# EAGLE design Arduboy Kit (EAGLE 9.7.0)
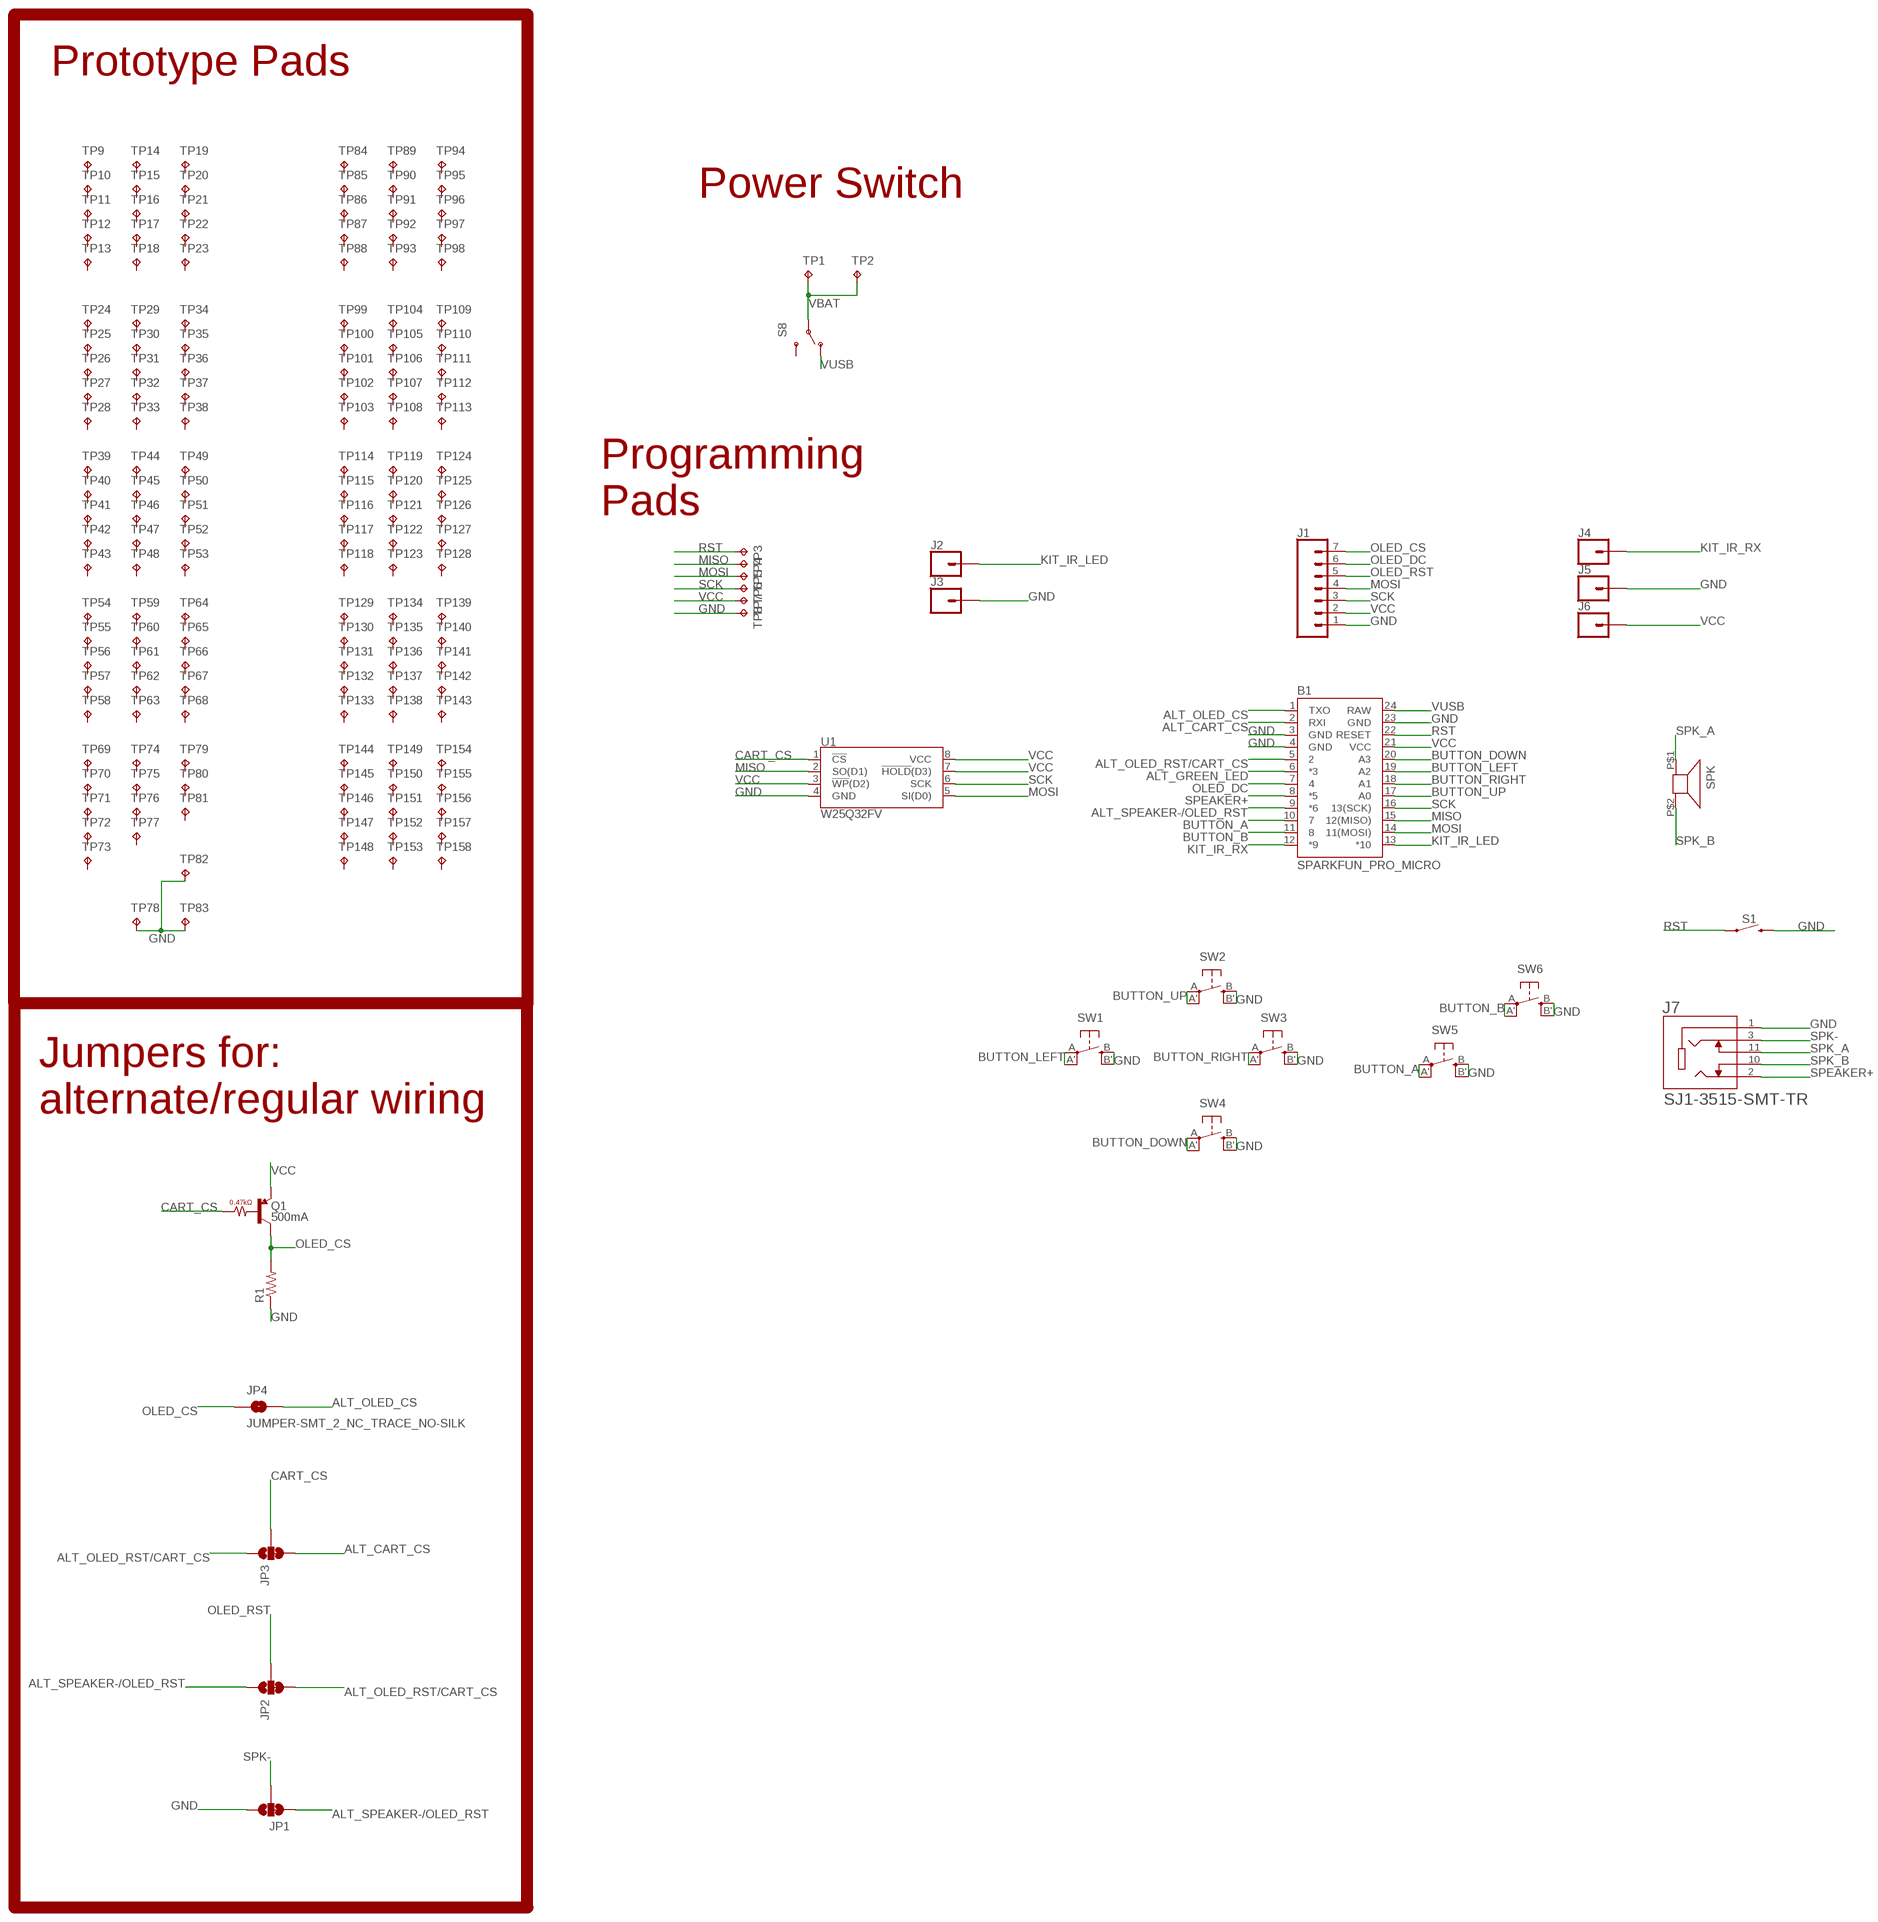
[diagram p0: schematic, sheet 1]

## Parts
B1  SPARKFUN_PRO_MICRO  [SPARKFUN_PRO_MICRO]
J1  CONN_07NO_SILK  [1X07_NO_SILK]
J2  CONN_01PAD  [1X01_SOLDER_PADS]
J3  CONN_01PAD  [1X01_SOLDER_PADS]
J4  CONN_01PAD  [1X01_SOLDER_PADS]
J5  CONN_01PAD  [1X01_SOLDER_PADS]
J6  CONN_01PAD  [1X01_SOLDER_PADS]
J7  SJ1-3515-SMT-TR  [CUI_SJ1-3515-SMT-TR]
JP1  JUMPER-SMT_3_1-NC_TRACE_NO-SILK  [SMT-JUMPER_3_1-NC_TRACE_NO-SILK]
JP2  JUMPER-SMT_3_1-NC_TRACE_NO-SILK  [SMT-JUMPER_3_1-NC_TRACE_NO-SILK]
JP3  JUMPER-SMT_3_1-NC_TRACE_NO-SILK  [SMT-JUMPER_3_1-NC_TRACE_NO-SILK]
JP4  JUMPER-SMT_2_NC_TRACE_NO-SILK  [SMT-JUMPER_2_NC_TRACE_NO-SILK]
Q1  500mA  TRANS_PNP_RES-DDTB142TC  [SOT23-3]
R1  R-US_R0805  [R0805]
S1  MOMENTARY-SWITCH-SPST-SMD-6.0X3.5MM  [TACTILE_SWITCH_SMD_6.0X3.5MM]
S8  SWITCH-SPDT-SMD-A  [SWITCH-SPST-SMD-A]
SPK  O_SPK_2_FLEX  [O_SPK_FLEX]
SW1  SPST_TACT-EVQQ2  [EVQ-Q2]
SW2  SPST_TACT-EVQQ2  [EVQ-Q2]
SW3  SPST_TACT-EVQQ2  [EVQ-Q2]
SW4  SPST_TACT-EVQQ2  [EVQ-Q2]
SW5  SPST_TACT-EVQQ2  [EVQ-Q2]
SW6  SPST_TACT-EVQQ2  [EVQ-Q2]
TP1  TPTP20SQ  [TP20SQ]
TP2  TPTP20SQ  [TP20SQ]
TP3  TPTP15SQ  [TP15SQ]
TP4  TPTP15SQ  [TP15SQ]
TP5  TPTP15SQ  [TP15SQ]
TP6  TPTP15SQ  [TP15SQ]
TP7  TPTP15SQ  [TP15SQ]
TP8  TPTP15SQ  [TP15SQ]
TP9  TPTP20SQ  [TP20SQ]
TP10  TPTP20SQ  [TP20SQ]
TP11  TPTP20SQ  [TP20SQ]
TP12  TPTP20SQ  [TP20SQ]
TP13  TPTP20SQ  [TP20SQ]
TP14  TPTP20SQ  [TP20SQ]
TP15  TPTP20SQ  [TP20SQ]
TP16  TPTP20SQ  [TP20SQ]
TP17  TPTP20SQ  [TP20SQ]
TP18  TPTP20SQ  [TP20SQ]
TP19  TPTP20SQ  [TP20SQ]
TP20  TPTP20SQ  [TP20SQ]
TP21  TPTP20SQ  [TP20SQ]
TP22  TPTP20SQ  [TP20SQ]
TP23  TPTP20SQ  [TP20SQ]
TP24  TPTP20SQ  [TP20SQ]
TP25  TPTP20SQ  [TP20SQ]
TP26  TPTP20SQ  [TP20SQ]
TP27  TPTP20SQ  [TP20SQ]
TP28  TPTP20SQ  [TP20SQ]
TP29  TPTP20SQ  [TP20SQ]
TP30  TPTP20SQ  [TP20SQ]
TP31  TPTP20SQ  [TP20SQ]
TP32  TPTP20SQ  [TP20SQ]
TP33  TPTP20SQ  [TP20SQ]
TP34  TPTP20SQ  [TP20SQ]
TP35  TPTP20SQ  [TP20SQ]
TP36  TPTP20SQ  [TP20SQ]
TP37  TPTP20SQ  [TP20SQ]
TP38  TPTP20SQ  [TP20SQ]
TP39  TPTP20SQ  [TP20SQ]
TP40  TPTP20SQ  [TP20SQ]
TP41  TPTP20SQ  [TP20SQ]
TP42  TPTP20SQ  [TP20SQ]
TP43  TPTP20SQ  [TP20SQ]
TP44  TPTP20SQ  [TP20SQ]
TP45  TPTP20SQ  [TP20SQ]
TP46  TPTP20SQ  [TP20SQ]
TP47  TPTP20SQ  [TP20SQ]
TP48  TPTP20SQ  [TP20SQ]
TP49  TPTP20SQ  [TP20SQ]
TP50  TPTP20SQ  [TP20SQ]
TP51  TPTP20SQ  [TP20SQ]
TP52  TPTP20SQ  [TP20SQ]
TP53  TPTP20SQ  [TP20SQ]
TP54  TPTP20SQ  [TP20SQ]
TP55  TPTP20SQ  [TP20SQ]
TP56  TPTP20SQ  [TP20SQ]
TP57  TPTP20SQ  [TP20SQ]
TP58  TPTP20SQ  [TP20SQ]
TP59  TPTP20SQ  [TP20SQ]
TP60  TPTP20SQ  [TP20SQ]
TP61  TPTP20SQ  [TP20SQ]
TP62  TPTP20SQ  [TP20SQ]
TP63  TPTP20SQ  [TP20SQ]
TP64  TPTP20SQ  [TP20SQ]
TP65  TPTP20SQ  [TP20SQ]
TP66  TPTP20SQ  [TP20SQ]
TP67  TPTP20SQ  [TP20SQ]
TP68  TPTP20SQ  [TP20SQ]
TP69  TPTP20SQ  [TP20SQ]
TP70  TPTP20SQ  [TP20SQ]
TP71  TPTP20SQ  [TP20SQ]
TP72  TPTP20SQ  [TP20SQ]
TP73  TPTP20SQ  [TP20SQ]
TP74  TPTP20SQ  [TP20SQ]
TP75  TPTP20SQ  [TP20SQ]
TP76  TPTP20SQ  [TP20SQ]
TP77  TPTP20SQ  [TP20SQ]
TP78  TPTP20SQ  [TP20SQ]
TP79  TPTP20SQ  [TP20SQ]
TP80  TPTP20SQ  [TP20SQ]
TP81  TPTP20SQ  [TP20SQ]
TP82  TPTP20SQ  [TP20SQ]
TP83  TPTP20SQ  [TP20SQ]
TP84  TPTP20SQ  [TP20SQ]
TP85  TPTP20SQ  [TP20SQ]
TP86  TPTP20SQ  [TP20SQ]
TP87  TPTP20SQ  [TP20SQ]
TP88  TPTP20SQ  [TP20SQ]
TP89  TPTP20SQ  [TP20SQ]
TP90  TPTP20SQ  [TP20SQ]
TP91  TPTP20SQ  [TP20SQ]
TP92  TPTP20SQ  [TP20SQ]
TP93  TPTP20SQ  [TP20SQ]
TP94  TPTP20SQ  [TP20SQ]
TP95  TPTP20SQ  [TP20SQ]
TP96  TPTP20SQ  [TP20SQ]
TP97  TPTP20SQ  [TP20SQ]
TP98  TPTP20SQ  [TP20SQ]
TP99  TPTP20SQ  [TP20SQ]
TP100  TPTP20SQ  [TP20SQ]
TP101  TPTP20SQ  [TP20SQ]
TP102  TPTP20SQ  [TP20SQ]
TP103  TPTP20SQ  [TP20SQ]
TP104  TPTP20SQ  [TP20SQ]
TP105  TPTP20SQ  [TP20SQ]
TP106  TPTP20SQ  [TP20SQ]
TP107  TPTP20SQ  [TP20SQ]
TP108  TPTP20SQ  [TP20SQ]
TP109  TPTP20SQ  [TP20SQ]
TP110  TPTP20SQ  [TP20SQ]
TP111  TPTP20SQ  [TP20SQ]
TP112  TPTP20SQ  [TP20SQ]
TP113  TPTP20SQ  [TP20SQ]
TP114  TPTP20SQ  [TP20SQ]
TP115  TPTP20SQ  [TP20SQ]
TP116  TPTP20SQ  [TP20SQ]
TP117  TPTP20SQ  [TP20SQ]
TP118  TPTP20SQ  [TP20SQ]
TP119  TPTP20SQ  [TP20SQ]
TP120  TPTP20SQ  [TP20SQ]
TP121  TPTP20SQ  [TP20SQ]
TP122  TPTP20SQ  [TP20SQ]
TP123  TPTP20SQ  [TP20SQ]
TP124  TPTP20SQ  [TP20SQ]
TP125  TPTP20SQ  [TP20SQ]
TP126  TPTP20SQ  [TP20SQ]
TP127  TPTP20SQ  [TP20SQ]
TP128  TPTP20SQ  [TP20SQ]
TP129  TPTP20SQ  [TP20SQ]
TP130  TPTP20SQ  [TP20SQ]
TP131  TPTP20SQ  [TP20SQ]
TP132  TPTP20SQ  [TP20SQ]
TP133  TPTP20SQ  [TP20SQ]
TP134  TPTP20SQ  [TP20SQ]
TP135  TPTP20SQ  [TP20SQ]
TP136  TPTP20SQ  [TP20SQ]
TP137  TPTP20SQ  [TP20SQ]
TP138  TPTP20SQ  [TP20SQ]
TP139  TPTP20SQ  [TP20SQ]
TP140  TPTP20SQ  [TP20SQ]
TP141  TPTP20SQ  [TP20SQ]
TP142  TPTP20SQ  [TP20SQ]
TP143  TPTP20SQ  [TP20SQ]
TP144  TPTP20SQ  [TP20SQ]
TP145  TPTP20SQ  [TP20SQ]
TP146  TPTP20SQ  [TP20SQ]
TP147  TPTP20SQ  [TP20SQ]
TP148  TPTP20SQ  [TP20SQ]
TP149  TPTP20SQ  [TP20SQ]
TP150  TPTP20SQ  [TP20SQ]
TP151  TPTP20SQ  [TP20SQ]
TP152  TPTP20SQ  [TP20SQ]
TP153  TPTP20SQ  [TP20SQ]
TP154  TPTP20SQ  [TP20SQ]
TP155  TPTP20SQ  [TP20SQ]
TP156  TPTP20SQ  [TP20SQ]
TP157  TPTP20SQ  [TP20SQ]
TP158  TPTP20SQ  [TP20SQ]
U1  W25Q32FV  W25Q32FVSS  [SOIC-8]

## Nets
ALT_CART_CS: B1.2(RXI) JP3.3
ALT_GREEN_LED: B1.6(*3)
ALT_OLED_CS: B1.1(TXO) JP4.2
ALT_OLED_RST/CART_CS: B1.5 JP2.3 JP3.1
ALT_SPEAKER-/OLED_RST: B1.9(*6) JP1.3 JP2.1
BUTTON_A: B1.10 SW5.A'(P1) SW5.A(P)
BUTTON_B: B1.11 SW6.A'(P1) SW6.A(P)
BUTTON_DOWN: B1.20(A3) SW4.A'(P1) SW4.A(P)
BUTTON_LEFT: B1.19(A2) SW1.A'(P1) SW1.A(P)
BUTTON_RIGHT: B1.18(A1) SW3.A'(P1) SW3.A(P)
BUTTON_UP: B1.17(A0) SW2.A'(P1) SW2.A(P)
CART_CS: JP3.2 Q1.1(B) U1.1(!CS!)
GND: B1.3(GND) B1.4(GND) B1.23(GND) J1.1 J3.1 J5.1 J7.1 JP1.1 R1.1 S1.2 SW1.B'(S1) SW1.B(S) SW2.B'(S1) SW2.B(S) SW3.B'(S1) SW3.B(S) SW4.B'(S1) SW4.B(S) SW5.B'(S1) SW5.B(S) SW6.B'(S1) SW6.B(S) TP8.TP TP78.TP TP82.TP TP83.TP U1.4(GND)
KIT_IR_LED: B1.13(*10) J2.1
KIT_IR_RX: B1.12(*9) J4.1
MISO: B1.15(12(MISO)) TP4.TP U1.2(SO(D1))
MOSI: B1.14(11(MOSI)) J1.4 TP5.TP U1.5(SI(D0))
OLED_CS: J1.7 JP4.1 Q1.3(C) R1.2
OLED_DC: B1.7 J1.6
OLED_RST: J1.5 JP2.2
RST: B1.22(RESET) S1.1 TP3.TP
SCK: B1.16(13(SCK)) J1.3 TP6.TP U1.6(SCK)
SPEAKER+: B1.8(*5) J7.2
SPK-: J7.3 JP1.2
SPK_A: J7.11 SPK.P$1
SPK_B: J7.10 SPK.P$2
VBAT: S8.2(P) TP1.TP TP2.TP
VCC: B1.21(VCC) J1.2 J6.1 Q1.2(E) TP7.TP U1.3(!WP!(D2)) U1.7(!HOLD!(D3)) U1.8(VCC)
VUSB: B1.24(RAW) S8.1(O)
Unconnected: S8.3(S) TP9.TP TP10.TP TP11.TP TP12.TP TP13.TP TP14.TP TP15.TP TP16.TP TP17.TP TP18.TP TP19.TP TP20.TP TP21.TP TP22.TP TP23.TP TP24.TP TP25.TP TP26.TP TP27.TP TP28.TP TP29.TP TP30.TP TP31.TP TP32.TP TP33.TP TP34.TP TP35.TP TP36.TP TP37.TP TP38.TP TP39.TP TP40.TP TP41.TP TP42.TP TP43.TP TP44.TP TP45.TP TP46.TP TP47.TP TP48.TP TP49.TP TP50.TP TP51.TP TP52.TP TP53.TP TP54.TP TP55.TP TP56.TP TP57.TP TP58.TP TP59.TP TP60.TP TP61.TP TP62.TP TP63.TP TP64.TP TP65.TP TP66.TP TP67.TP TP68.TP TP69.TP TP70.TP TP71.TP TP72.TP TP73.TP TP74.TP TP75.TP TP76.TP TP77.TP TP79.TP TP80.TP TP81.TP TP84.TP TP85.TP TP86.TP TP87.TP TP88.TP TP89.TP TP90.TP TP91.TP TP92.TP TP93.TP TP94.TP TP95.TP TP96.TP TP97.TP TP98.TP TP99.TP TP100.TP TP101.TP TP102.TP TP103.TP TP104.TP TP105.TP TP106.TP TP107.TP TP108.TP TP109.TP TP110.TP TP111.TP TP112.TP TP113.TP TP114.TP TP115.TP TP116.TP TP117.TP TP118.TP TP119.TP TP120.TP TP121.TP TP122.TP TP123.TP TP124.TP TP125.TP TP126.TP TP127.TP TP128.TP TP129.TP TP130.TP TP131.TP TP132.TP TP133.TP TP134.TP TP135.TP TP136.TP TP137.TP TP138.TP TP139.TP TP140.TP TP141.TP TP142.TP TP143.TP TP144.TP TP145.TP TP146.TP TP147.TP TP148.TP TP149.TP TP150.TP TP151.TP TP152.TP TP153.TP TP154.TP TP155.TP TP156.TP TP157.TP TP158.TP

## Notes on the sheet
- Prototype Pads
- Power Switch
- Programming
  Pads
- Jumpers for:
  alternate/regular wiring

## Library data of the parts
B1 = SparkFun-Boards:SPARKFUN_PRO_MICRO: SparkFun Pro Micro Atmega32U4 compatible footprint. SparkFun Products: 3.3V/8MHz <https://www.sparkfun.com/products/12587> 5V/16MHz <https://www.sparkfun.com/products/12640>
J1 = Arduboy Kit v14:CONN_07: Multi connection point. Often used as Generic Header-pin footprint for 0.1 inch spaced/style header connections On any of the 0.1 inch spaced packages, you can populate with these: Break Away Headers - Straight <https://www.sparkfun.com/products/116> (PRT-00116) Break Away Male Headers - Right Angle <https://www.sparkfun.com/products/553> (PRT-00553) Female Headers <https://www.sparkfun.com/products/115> (PRT-00115) Break Away Headers - Machine Pin <https://www.sparkfun.com/products/117> (PRT-00117) Break Away Female Headers - Swiss Machine Pin <https://www.sparkfun.com/products/743> (PRT-00743) For SCREWTERMINALS and SPRING TERMINALS visit here: Screw Terimnals on SparkFun.com <https://www.sparkfun.com/search/results?term=Screw+Terminals> (5mm/3.5mm/2.54mm spacing) This device is also useful as a general connection point to wire up your design to another part of your project. Our various solder wires solder well into these plated through hole pads. Hook-Up Wire - Assortment (Stranded, 22 AWG) <https://www.sparkfun.com/products/11375> (PRT-11375) Hook-Up Wire - Assortment (Solid Core, 22 AWG) <https://www.sparkfun.com/products/11367> (PRT-11367) View the entire wire category on our website here <https://www.sparkfun.com/categories/141> Special notes: Molex polarized connector foot print use with SKU : PRT-08231 with associated crimp pins and housings. 1MM SMD Version SKU: PRT-10208 NOTES ON THE VARIANTS LOCK and LOCK_LONGPADS... This footprint was designed to help hold the alignment of a through-hole component (i.e. 6-pin header) while soldering it into place. You may notice that each hole has been shifted either up or down by 0.005 of an inch from it's more standard position (which is a perfectly straight line). This slight alteration caused the pins (the squares in the middle) to touch the edges of the holes. Because they are alternating, it causes a "brace" to hold the component in place. 0.005 has proven to be the perfect amount of "off-center" position when using our standard breakaway headers. Although looks a little odd when you look at the bare footprint, once you have a header in there, the alteration is very hard to notice. Also,if you push a header all the way into place, it is covered up entirely on the bottom side.
J2-J6 = Arduboy Kit v14:CONN_01: Single connection point. Often used as Generic Header-pin footprint for 0.1 inch spaced/style header connections On any of the 0.1 inch spaced packages, you can populate with these: Break Away Headers - Straight <https://www.sparkfun.com/products/116> (PRT-00116) Break Away Male Headers - Right Angle <https://www.sparkfun.com/products/553> (PRT-00553) Female Headers <https://www.sparkfun.com/products/115> (PRT-00115) Break Away Headers - Machine Pin <https://www.sparkfun.com/products/117> (PRT-00117) Break Away Female Headers - Swiss Machine Pin <https://www.sparkfun.com/products/743> (PRT-00743) This device is also useful as a general connection point to wire up your design to another part of your project. Our various solder wires solder well into these plated through hole pads. Hook-Up Wire - Assortment (Stranded, 22 AWG) <https://www.sparkfun.com/products/11375> (PRT-11375) Hook-Up Wire - Assortment (Solid Core, 22 AWG) <https://www.sparkfun.com/products/11367> (PRT-11367) View the entire wire category on our website here <https://www.sparkfun.com/categories/141> Special notes: SMTSO-256-ET is a "flush mount" nut for a 4-40 screw. We mostly use this on specialty testbeds; it is a nice way to connect hardware to your PCB at an adjustable hieght. Also note, the SNAP packages are for using a snappable style connector. We sell a baggie of snaps and they are also used on two LilyPad designs: Snap Assortment - 30 pack (male and female) <https://www.sparkfun.com/products/11347> (DEV-11347) LilyPad Arduino SimpleSnap <https://www.sparkfun.com/products/10941> (DEV-10941) LilyPad SimpleSnap Protoboard <https://www.sparkfun.com/products/10940> (DEV-10940)
J7 = Arduboy Kit v14:SJ1-3515-SMT-TR: Check availability <https://pricing.snapeda.com/parts/SJ1-3515-SMT-TR/CUI%20Devices/view-part?ref=eda>; AVAILABILITY: In Stock; CHECK_PRICES: https://www.snapeda.com/parts/SJ1-3515-SMT-TR/CUI+Devices/view-part/?ref=eda; CUI_PURCHASE_URL: https://www.cuidevices.com/product/interconnect/connectors/audio-connectors/jacks/sj1-3515-smt-tr?utm_source=snapeda.com&utm_medium=referral&utm_campaign=snapedaBOM; DESCRIPTION: 3.5 mm, Stereo, Right Angle, Surface Mount (SMT), 3 Conductors, 2 Internal Switches, Audio Jack Connector; MF: CUI Devices; MP: SJ1-3515-SMT-TR; PACKAGE: None; PRICE: None; PURCHASE-URL: https://www.snapeda.com/api/url_track_click_mouser/?unipart_id=55439&manufacturer=CUI Devices&part_name=SJ1-3515-SMT-TR&search_term=sj1-3515-smt-tr; SNAPEDA_LINK: https://www.snapeda.com/parts/SJ1-3515-SMT-TR/CUI+Devices/view-part/?ref=snap
JP1-JP3 = SparkFun-Jumpers:JUMPER-SMT_3_1-NC_TRACE: Normally closed trace jumper (1 of 2 connections) This jumper has a trace between two pads so it's normally closed (NC). The other connection is normally open (NO). Use a razor knife to open the connection. For best results follow the IPC guidelines for cutting traces: Cutout at least 0.063 mm (0.005 in). Remove all loose material to clean up the cut area. Seal the cut with an approved epoxy. Reapply solder to reclose the connection, or to close the NO connection.
JP4 = SparkFun-Jumpers:JUMPER-SMT_2_NC_TRACE: Normally closed trace jumper This jumper has a trace between two pads so it's normally closed (NC). Use a razor knife to open the connection. For best results follow the IPC guidelines for cutting traces: Cutout at least 0.063 mm (0.005 in). Remove all loose material to clean up the cut area. Seal the cut with an approved epoxy. Reapply solder to reclose the connection.
Q1 = SparkFun-DiscreteSemi:TRANS_PNP_RES: PNP transistor with built in base resistor Current controlled device with built in current control for tighter layouts. Link to datasheet <http://www.diodes.com/_files/datasheets/ds30403.pdf>. SparkFun Products: SparkFun OpenSegment Serial Display - White <https://www.sparkfun.com/products/11644> SparkFun OpenSegment Serial Display - Red <https://www.sparkfun.com/products/11644>; PROD_ID: TRANS-11479
R1 = adafruit:R-US_: RESISTOR, American symbol
S1 = Arduboy Kit v14:MOMENTARY-SWITCH-SPST: Momentary Switch (Pushbutton) - SPST Normally-open (NO) SPST momentary switches (buttons, pushbuttons). Variants PTH-12MM - 12mm square, through-hole Momentary Pushbutton Switch - 12mm Square <https://www.sparkfun.com/products/9190> (COM-09190) PTH-6.0MM, PTH-6.0MM-KIT - 6.0mm square, through-hole Mini Pushbutton Switch <https://www.sparkfun.com/products/97> (COM-00097) KIT package intended for soldering kit's - only one side of pads' copper is exposed. PTH-RIGHT-ANGLE-KIT - Right-angle, through-hole Right Angle Tactile Button <https://www.sparkfun.com/products/10791> - Used on SparkFun BigTime Watch Kit <https://www.sparkfun.com/products/11734> SMD-12MM - 12mm square, surface-mount Tactile Button - SMD (12mm) <https://www.sparkfun.com/products/12993> (COM-12993) Used on SparkFun PicoBoard <https://www.sparkfun.com/products/11888> SMD-4.5MM - 4.5mm Square Trackball Switch Used on SparkFun Blackberry Trackballer Breakout <https://www.sparkfun.com/products/13169> SMD-4.6MMX2.8MM - 4.60mm x 2.80mm, surface mount Used on SparkFun Pro Micro - RP2040 <https://www.sparkfun.com/products/17717> SMD-5.2MM, SMD-5.2-REDUNDANT - 5.2mm square, surface-mount Mini Pushbutton Switch - SMD <https://www.sparkfun.com/products/8720> (COM-08720) Used on Arduino Pro Mini <https://www.sparkfun.com/products/11114> REDUNDANT package connects both switch circuits together SMD-6.0X3.5MM - 6.0 x 3.5mm, surface mount Momentary Reset Switch SMD <https://www.sparkfun.com/products/8229> (COM-08229) SMD-6.2MM-TALL - 6.2mm square, surface mount Tactile Button - SMD (6mm) <https://www.sparkfun.com/products/12992> Used on SparkFun Digital Sandbox <https://www.sparkfun.com/products/12651> SMD-RIGHT-ANGLE - Right-angle, surface mount Used on SparkFun Block for Intel® Edison - Arduino <https://www.sparkfun.com/products/13036>; PROD_ID: SWCH-14278; SF_SKU: COM-08229
S8 = SparkFun-Electromechanical:SWITCH-SPDT: SPDT Switch Simple slide switch, Spark Fun Electronics SKU : COM-00102 DPDT SMT slide switch, AYZ0202, SWCH-08179
SPK = Arduboy Kit v14:O_SPK_2_FLEX
SW1-SW6 = Arduboy Kit v14:SPST_TACT: SMT 6mm switch, EVQQ2 series http://www.ladyada.net/library/eagle
TP1 TP2 TP9-TP158 = ArduboyFXC v3:TP: Test pad
TP3-TP8 = testpad:TP: Test pad
U1 = ArduboyFXC v3:W25Q32FV: W25Q32FV 32Mb (4MB) Serial Flash Memory The W25Q32FV support the standard Serial Peripheral Interface (SPI), Dual/Quad I/O SPI as well as 2-clocks instruction cycle Quad Peripheral Interface (QPI). 104MHz, SPI, 8-SOIC-EIAJ Datasheet <http://www.winbond.com/resource-files/w25q32fv%20revh%20091613.pdf> SparkFun Products SparkFun Blynk Board - ESP8266 <https://www.sparkfun.com/products/13794> (WRL-13794); PROD_ID: IC-13229

## Board
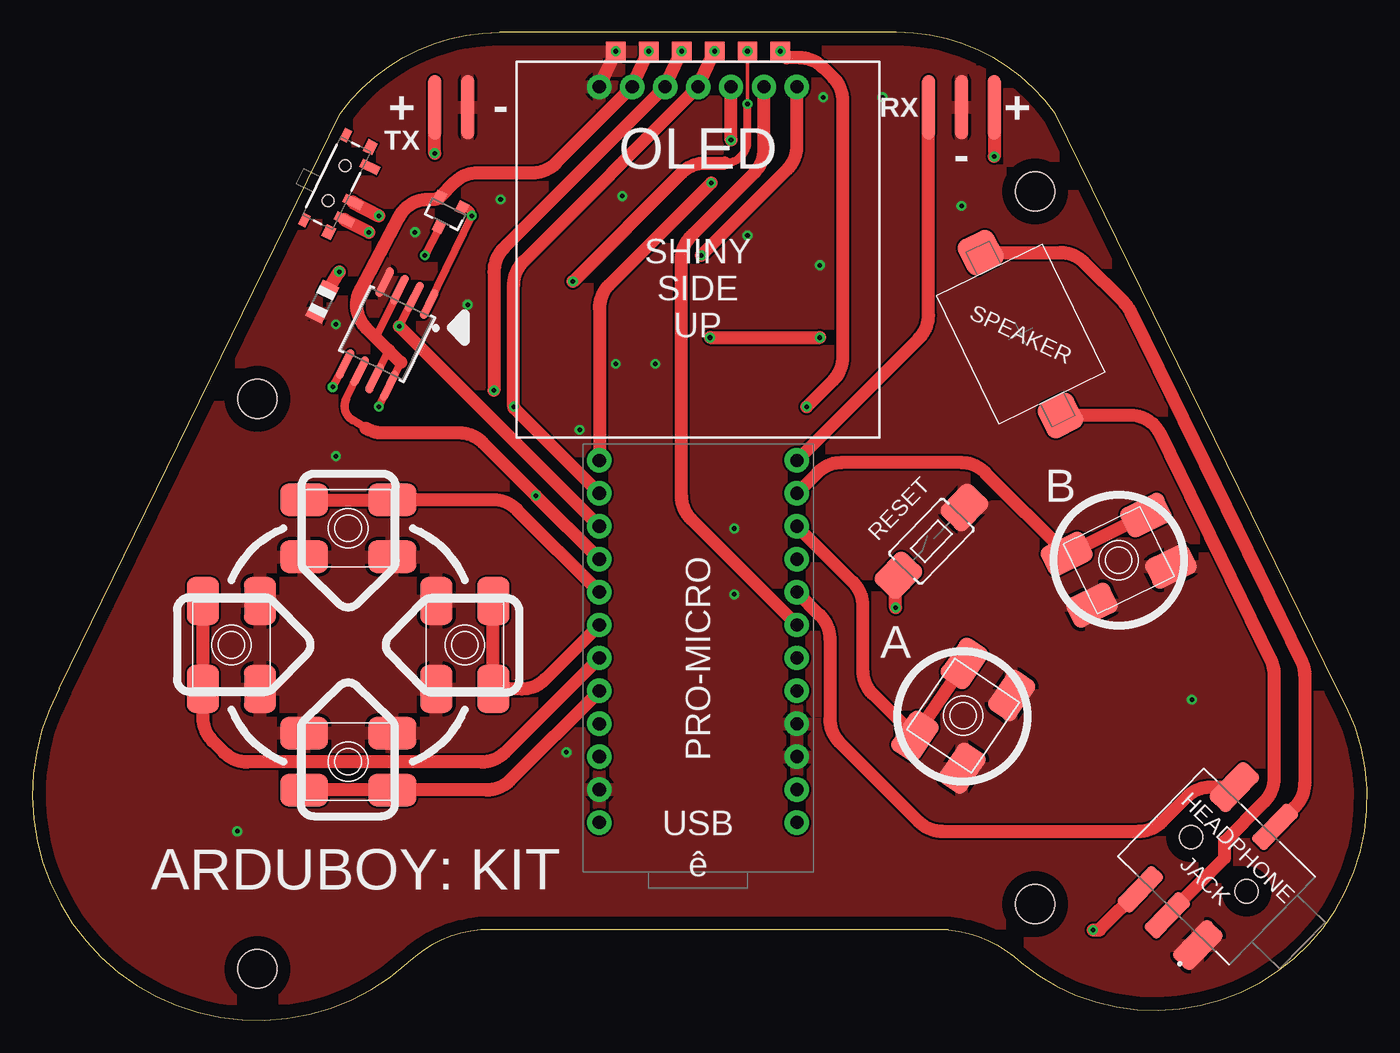
[diagram p1: board, top side]
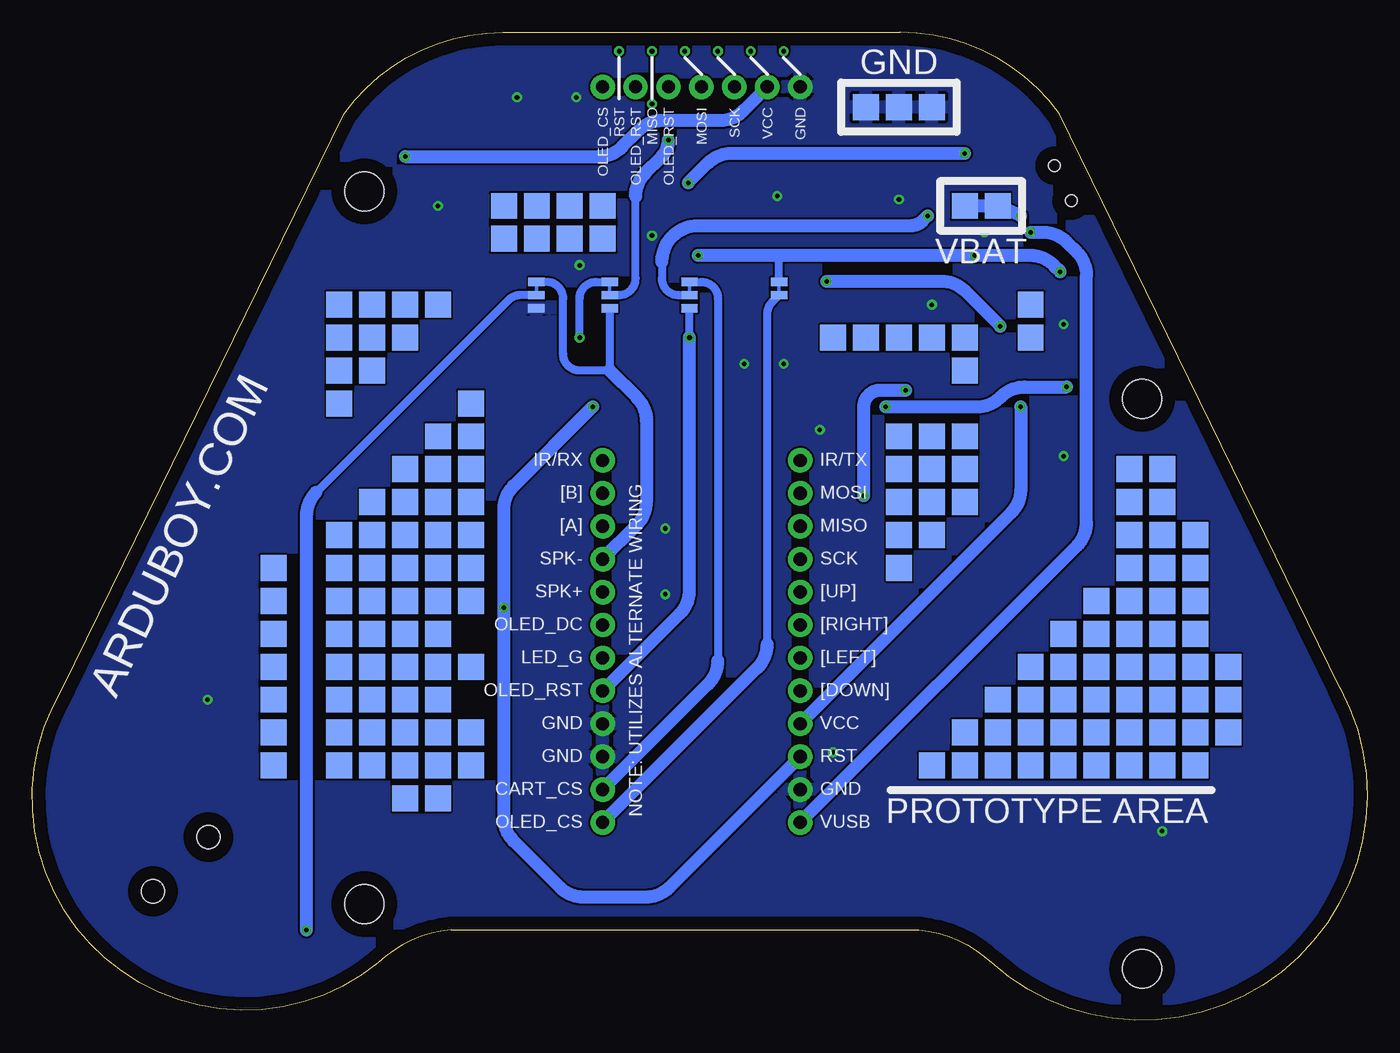
[diagram p2: board, bottom side, seen from below]

Size 102.98 x 76.22 mm. Coordinates in mm from the lower left corner, seen from the top.
Outline: 70.69,6.95 34.57,6.95 arc39 28.96,4.41 arc-160 2.06,25.59 23.76,69.96 arc-54 36.04,76.22 66.66,76.22 arc-54 78.94,69.96 100.66,25.56 arc-160 76.3,4.41 arc39 70.69,6.95
Copper layers (1*16): Top 0.035mm / dielectric 1.5mm / Bottom 0.035mm
Design rules "default *": minimum track width 6mil, minimum drill 0.35mm, track to track 6mil, track to pad 6mil, pad to pad 6mil, via to via 6mil, smd to smd 6mil, copper to edge 40mil, drill to drill 6mil, minimum pad ring 10mil, minimum via ring 8mil, stop-mask expansion 4mil, vias tented up to drill 14mil, thermal gap 10mil
Holes 3 mm at 17.36,3.95 77.36,63.95 17.36,47.95 77.36,8.95

### Footprints (pad centres in the part's own frame; a part is rotated, then mirrored left to right if it is on the bottom)
SPARKFUN_PRO_MICRO = drill 1.016 pad 1.88: 1 -7.62,12.7; 2 -7.62,10.16; 3 -7.62,7.62; 4 -7.62,5.08; 5 -7.62,2.54; 6 -7.62,0; 7 -7.62,-2.54; 8 -7.62,-5.08; 9 -7.62,-7.62; 10 -7.62,-10.16; 11 -7.62,-12.7; 12 -7.62,-15.24; 13 7.62,-15.24; 14 7.62,-12.7; 15 7.62,-10.16; 16 7.62,-7.62; 17 7.62,-5.08; 18 7.62,-2.54; 19 7.62,0; 20 7.62,2.54; 21 7.62,5.08; 22 7.62,7.62; 23 7.62,10.16; 24 7.62,12.7
1X07_NO_SILK = drill 1.016 pad 1.88: 1 0,0; 2 2.54,0; 3 5.08,0; 4 7.62,0; 5 10.16,0; 6 12.7,0; 7 15.24,0
1X01_SOLDER_PADS = smd 5 x 1: 1 0,0
CUI_SJ1-3515-SMT-TR = smd 2 x 4: 1 -3.2,5.6; 2 3.3,-5.1 | smd 1.5 x 4: 3 3,5.6; 10 -1.1,-5.1; 11 0.1,5.6 | hole 1.8: -3,0; 3,0
SMT-JUMPER_3_1-NC_TRACE_NO-SILK = smd 0.635 x 1.27: 1 -1.016,0; 2 0,0; 3 1.016,0
SMT-JUMPER_2_NC_TRACE_NO-SILK = smd 0.635 x 1.27: 1 -0.508,0; 2 0.508,0
SOT23-3 = smd 0.8 x 0.9: 1 -0.95,-1; 2 0.95,-1; 3 0,1.1
R0805 = smd 1.1 x 1.4: 1 -1,0; 2 1,0
TACTILE_SWITCH_SMD_6.0X3.5MM = smd 3.3 x 2.6: 1 -3.65,0; 2 3.65,0
SWITCH-SPST-SMD-A = smd 0.7 x 1.5: 1 -2.25,-1.75; 2 -0.75,-1.75; 3 2.25,-1.75 | smd 1 x 0.6: GND1 -3.65,1; GND3 3.65,1 | smd 1 x 0.8: GND2 -3.65,-1.1; GND4 3.65,-1.1 | hole 0.9: -1.5,0; 1.5,0
O_SPK_FLEX = smd 3 x 3: P$1 0,7; P$2 0,-7
EVQ-Q2 = smd 3.7 x 2.5: A -3.4,-2.2; A' 3.4,-2.2; B -3.4,2.2; B' 3.4,2.2
TP20SQ = smd 2 x 2: TP 0,0
TP15SQ = smd 1.5 x 1.5: TP 0,0
SOIC-8 = smd 0.61 x 2.464: 1 -1.905,-3.505; 2 -0.635,-3.505; 3 0.635,-3.505; 4 1.905,-3.505; 5 1.905,3.505; 6 0.635,3.505; 7 -0.635,3.505; 8 -1.905,3.505

### Placement (x,y rotation side)
B1  51.36,27.95 180 top
J1  43.74,72.02 0 top
J2  31.04,70.45 90 top
J3  33.58,70.45 90 top
J4  69.14,70.45 90 top
J5  71.68,70.45 90 top
J6  74.22,70.45 90 top
J7  91.54,12.03 135.8 top
JP1  64.1,55.95 90 bottom
JP2  58.44,55.95 90 bottom
JP3  52.28,55.95 90 bottom
JP4  45.36,56.46 270 bottom
Q1  31.86,62.21 154 top
R1  22.36,55.45 64 top
S1  69.36,36.95 45.8 top
S8  23.48,64.58 64 top
SPK  76.24,52.96 206.1 top
SW1  15.36,28.95 270 top
SW2  24.36,37.95 180 top
SW3  33.36,28.95 90 top
SW4  24.36,19.95 0 top
SW5  71.82,23.49 235.8 top
SW6  83.82,35.49 206.1 top
TP1  28.5,62.83 0 bottom
TP2  31.04,62.83 0 bottom
TP3  57.71,74.77 270 top
TP4  55.17,74.77 0 top
TP5  52.63,74.77 0 top
TP6  50.09,74.77 0 top
TP7  47.55,74.77 0 top
TP8  45.01,74.77 0 top
TP9  36.12,45.05 0 bottom
TP10  36.12,42.51 0 bottom
TP11  36.12,39.97 0 bottom
TP12  36.12,37.43 0 bottom
TP13  36.12,34.89 0 bottom
TP14  33.58,45.05 0 bottom
TP15  33.58,37.43 0 bottom
TP16  33.58,42.51 0 bottom
TP17  10.72,22.19 0 bottom
TP18  33.58,39.97 0 bottom
TP19  31.04,45.05 0 bottom
TP20  10.72,27.27 0 bottom
TP21  31.04,42.51 0 bottom
TP22  10.72,24.73 0 bottom
TP23  31.04,39.97 0 bottom
TP24  18.34,42.51 0 bottom
TP25  15.8,42.51 0 bottom
TP26  20.88,32.35 0 bottom
TP27  18.34,39.97 0 bottom
TP28  15.8,39.97 0 bottom
TP29  20.88,29.81 0 bottom
TP30  18.34,37.43 0 bottom
TP31  15.8,37.43 0 bottom
TP32  13.26,37.43 0 bottom
TP33  18.34,34.89 0 bottom
TP34  15.8,34.89 0 bottom
TP35  13.26,34.89 0 bottom
TP36  18.34,32.35 0 bottom
TP37  15.8,32.35 0 bottom
TP38  13.26,32.35 0 bottom
TP39  18.34,29.81 0 bottom
TP40  15.8,29.81 0 bottom
TP41  13.26,29.81 0 bottom
TP42  18.34,27.27 0 bottom
TP43  15.8,27.27 0 bottom
TP44  13.26,27.27 0 bottom
TP45  18.34,24.73 0 bottom
TP46  15.8,24.73 0 bottom
TP47  13.26,24.73 0 bottom
TP48  18.34,22.19 0 bottom
TP49  15.8,22.19 0 bottom
TP50  13.26,22.19 0 bottom
TP51  18.34,19.65 0 bottom
TP52  15.8,19.65 0 bottom
TP53  13.26,19.65 0 bottom
TP54  33.58,52.67 0 bottom
TP55  31.04,52.67 0 bottom
TP56  31.04,50.13 0 bottom
TP57  36.12,52.67 0 bottom
TP58  38.66,52.67 0 bottom
TP59  20.88,19.65 0 bottom
TP60  28.5,19.65 0 bottom
TP61  25.96,19.65 0 bottom
TP62  23.42,19.65 0 bottom
TP63  31.04,22.19 0 bottom
TP64  33.58,19.65 0 bottom
TP65  31.04,19.65 0 bottom
TP66  28.5,22.19 0 bottom
TP67  25.96,22.19 0 bottom
TP68  23.42,22.19 0 bottom
TP69  20.88,27.27 0 bottom
TP70  20.88,24.73 0 bottom
TP71  20.88,22.19 0 bottom
TP72  23.42,24.73 0 bottom
TP73  23.42,27.27 0 bottom
TP74  23.42,29.81 0 bottom
TP75  28.5,24.73 0 bottom
TP76  25.96,24.73 0 bottom
TP77  25.96,27.27 0 bottom
TP78  33.58,70.45 0 bottom
TP79  25.96,52.67 0 bottom
TP80  25.96,55.21 0 bottom
TP81  41.2,52.67 0 bottom
TP82  38.66,70.45 0 bottom
TP83  36.12,70.45 0 bottom
TP84  79.3,19.65 0 bottom
TP85  76.76,19.65 0 bottom
TP86  74.22,19.65 0 bottom
TP87  71.68,19.65 0 bottom
TP88  79.3,50.13 0 bottom
TP89  79.3,52.67 0 bottom
TP90  79.3,55.21 0 bottom
TP91  76.76,52.67 0 bottom
TP92  76.76,55.21 0 bottom
TP93  74.22,55.21 0 bottom
TP94  71.68,55.21 0 bottom
TP95  84.38,24.73 0 bottom
TP96  84.38,27.27 0 bottom
TP97  84.38,29.81 0 bottom
TP98  84.38,32.35 0 bottom
TP99  84.38,34.89 0 bottom
TP100  61.52,60.29 0 bottom
TP101  58.98,60.29 0 bottom
TP102  84.38,22.19 0 bottom
TP103  66.6,62.83 0 bottom
TP104  64.06,62.83 0 bottom
TP105  61.52,62.83 0 bottom
TP106  58.98,62.83 0 bottom
TP107  76.76,39.97 0 bottom
TP108  74.22,42.51 0 bottom
TP109  71.68,45.05 0 bottom
TP110  69.14,19.65 0 bottom
TP111  79.3,47.59 0 bottom
TP112  79.3,22.19 0 bottom
TP113  76.76,22.19 0 bottom
TP114  74.22,22.19 0 bottom
TP115  71.68,22.19 0 bottom
TP116  69.14,22.19 0 bottom
TP117  79.3,24.73 0 bottom
TP118  74.22,52.67 0 bottom
TP119  76.76,50.13 0 bottom
TP120  69.14,47.59 0 bottom
TP121  84.38,19.65 0 bottom
TP122  66.6,60.29 0 bottom
TP123  64.06,60.29 0 bottom
TP124  69.14,37.43 0 bottom
TP125  71.68,39.97 0 bottom
TP126  69.14,39.97 0 bottom
TP127  74.22,39.97 0 bottom
TP128  71.68,42.51 0 bottom
TP129  69.14,42.51 0 bottom
TP130  69.14,45.05 0 bottom
TP131  74.22,34.89 0 bottom
TP132  71.68,34.89 0 bottom
TP133  69.14,34.89 0 bottom
TP134  79.3,37.43 0 bottom
TP135  76.76,37.43 0 bottom
TP136  74.22,37.43 0 bottom
TP137  71.68,37.43 0 bottom
TP138  79.3,32.35 0 bottom
TP139  76.76,32.35 0 bottom
TP140  74.22,32.35 0 bottom
TP141  71.68,32.35 0 bottom
TP142  69.14,32.35 0 bottom
TP143  79.3,34.89 0 bottom
TP144  76.76,34.89 0 bottom
TP145  71.68,27.27 0 bottom
TP146  69.14,27.27 0 bottom
TP147  79.3,29.81 0 bottom
TP148  76.76,29.81 0 bottom
TP149  74.22,29.81 0 bottom
TP150  71.68,29.81 0 bottom
TP151  71.68,17.11 0 bottom
TP152  76.76,24.73 0 bottom
TP153  74.22,24.73 0 bottom
TP154  71.68,24.73 0 bottom
TP155  74.22,17.11 0 bottom
TP156  79.3,27.27 0 bottom
TP157  76.76,27.27 0 bottom
TP158  74.22,27.27 0 bottom
U1  27.36,52.95 154 top

### Tracks (layer width: path | path; a pad name or v marks a point on that pad's centre or on a via)
ALT_CART_CS
  Bottom 0.61: JP3.3 51.36,56.97 arc90 50.09,55.7 50.09,27.74
  Bottom 1.016: B1.2 50.84,25.94 arc-45 50.09,27.74
ALT_OLED_CS
  Bottom 0.61: 46.28,29.01 46.28,54.51 arc45 45.91,55.41 JP4.2
  Bottom 1.016: B1.1 47.03,27.21 arc-45 46.28,29.01
ALT_OLED_RST/CART_CS  (via drill 0.35)
  Top 1.016: v52.28,52.67 v60.76,52.67
  Bottom 0.61: v52.28,52.67 JP3.1 | v60.76,52.67 60.76,55.7 arc90 59.49,56.97 JP2.3
  Bottom 1.016: B1.5 53.03,31.37 arc-45 52.28,33.17 v52.28,52.67
ALT_SPEAKER-/OLED_RST
  Bottom 0.61: JP2.1 58.44,50.13 60.76,50.13 arc90 62.03,51.4 62.03,55.7 arc-90 63.3,56.97 JP1.3
  Bottom 1.016: B1.9 56.35,38.21 arc-45 55.61,40 55.61,46.24 arc-45 56.35,48.04 58.44,50.13
BUTTON_A
  Top 1.016: B1.10 63.32,33.78 arc-45 64.06,31.98 64.06,27 arc45 64.81,25.2 SW5.A' SW5.A
BUTTON_B
  Top 1.016: B1.11 60.61,42.28 arc-45 62.4,43.02 71.7,43.02 arc-45 73.5,42.28 SW6.A' SW6.A
BUTTON_DOWN
  Top 1.016: B1.20 36.83,18.5 arc-45 35.03,17.75 SW4.A' SW4.A
BUTTON_LEFT
  Top 1.016: B1.19 36.45,20.66 arc-45 34.66,19.92 16.59,19.92 arc-45 14.8,20.66 13.91,21.55 arc-45 13.16,23.35 SW1.A' SW1.A
BUTTON_RIGHT
  Top 1.016: SW3.A' SW3.A 37.75,25.55 arc45 39.55,26.3 B1.18
BUTTON_UP
  Top 1.016: SW2.A' SW2.A 35.57,40.15 arc-45 37.37,39.41 B1.17
CART_CS  (via drill 0.35)
  Top 0.61: U1.1 v33.91,62.07 arc90 33.29,62.69 Q1.1
  Bottom 0.61: 54.41,58.52 54.41,57.22 arc-90 53.14,55.95 JP3.2
  Bottom 1.016: 54.41,58.52 arc90 51.62,61.31 35.2,61.31 arc-45 34.3,61.68 v33.91,62.07
GND  (via drill 0.35)
  Top 1.016: J1.1 TP8.TP
  other vias: 29.52,60.8 55.17,60.55 60.76,58.26 61.02,71.22 65.59,71.22 42.22,45.56 33.58,55.21 36.12,63.34 45.52,63.6 54.16,37.94 54.16,32.86 48.06,50.64 45.01,50.64 89.46,24.73 71.68,62.83 15.8,14.57 41.2,20.67 23.42,43.53 23.42,53.69
  pour Bottom: -1.47,-0.16 104.2,-0.16 104.2,77.57 -1.47,77.57
  pour Top: -1.47,-0.16 104.2,-0.16 104.2,77.57 -1.47,77.57
KIT_IR_LED  (via drill 0.35)
  Top 1.016: v31.04,66.9 J2.1 | v52.38,64.61 44.49,56.72 arc45 43.74,54.92 B1.13
  Bottom 1.016: v52.38,64.61 50.84,66.15 arc45 49.04,66.9 v31.04,66.9
KIT_IR_RX
  Top 1.016: B1.12 68.4,52.61 arc45 69.14,54.41 J4.1
MISO  (via drill 0.35)
  Top 0.254: v55.17,70.71 TP4.TP
  Top 0.61: U1.2 v28.3,53.55 | 53.44,66.14 arc90 55.17,67.87 v55.17,70.71
  Top 1.016: v41.71,57.01 50.1,65.39 arc-45 51.89,66.14 53.44,66.14 | v28.3,53.55 B1.15
  Bottom 0.254: v55.17,70.71 TP4.TP
  Bottom 1.016: v28.3,53.55 31.01,56.26 arc-45 32.81,57.01 v41.71,57.01
MOSI  (via drill 0.35)
  Top 0.61: v23.17,48.86 U1.5
  Top 1.016: B1.14 37.2,47.2 arc-45 v37.14,47.34 37.14,56.75 arc-45 37.88,58.54 J1.4 TP5.TP
  Bottom 1.016: v37.14,47.34 30.06,47.34 arc-45 28.27,48.08 28.23,48.12 arc45 26.44,48.86 v23.17,48.86
N$1  (via drill 0.35)
  other vias: 45.01,74.77
N$2  (via drill 0.35)
  other vias: 47.55,74.77
N$3  (via drill 0.35)
  other vias: 50.09,74.77
N$4  (via drill 0.35)
  other vias: 52.63,74.77
N$5  (via drill 0.35)
  other vias: 55.17,74.77
N$6  (via drill 0.35)
  other vias: 57.71,74.77
OLED_CS  (via drill 0.35)
  Top 0.61: Q1.3 31.37,61.13 v30.28,59.02
  Top 1.016: R1.2 v23.68,57.75 | v51.62,59.02 58.24,65.65 arc45 58.98,67.44 J1.7
  Bottom 0.61: JP4.1 45.36,59.02 45.27,59.02
  Bottom 1.016: v51.62,59.02 45.27,59.02 v30.28,59.02 26,59.02 arc45 24.2,58.28 v23.68,57.75
OLED_DC
  Top 1.016: B1.7 50.84,38.64 arc-45 50.09,40.44 50.09,58.73 arc-45 50.84,60.53 50.98,60.68 55.7,65.39 arc45 56.44,67.19 J1.6
OLED_RST  (via drill 0.35)
  Top 1.016: v53.9,67.91 J1.5
  Bottom 0.61: JP2.2 57.71,55.95 arc-90 56.44,57.22 56.44,63.56
  Bottom 1.016: 56.44,63.56 arc45 55.7,65.36 54.44,66.61 arc-45 v53.9,67.91
RST  (via drill 0.35)
  Top 1.016: v66.6,31.85 66.6,34.12 S1.1 | v59.75,47.34 61.8,49.39 arc45 62.54,51.19 62.54,70.93 arc45 61.8,72.72 61,73.52 arc45 59.2,74.26 58.22,74.26 TP3.TP
  Bottom 1.016: B1.22 53.84,10.24 arc45 55.64,9.49 60.47,9.49 arc45 62.27,10.24 65.86,13.83 arc45 66.6,15.63 v66.6,31.85 66.6,39.43 arc45 65.86,41.23 v59.75,47.34
SCK  (via drill 0.35)
  Top 0.61: 25.71,45.68 24.7,46.3 arc-84 24.22,47.94 U1.6
  Top 1.016: B1.16 v38.84,40.48 34.75,44.56 arc45 32.96,45.31 27.04,45.31 arc-32 25.71,45.68 | v35.62,48.61 35.62,57.76 arc-45 36.36,59.56 J1.3 TP6.TP
  Bottom 1.016: v38.84,40.48 38.84,47.34 arc90 37.57,48.61 v35.62,48.61
SPEAKER+
  Top 1.016: B1.8 60.78,31.24 arc-45 61.52,29.44 61.52,23.25 arc45 62.27,21.45 68.4,15.32 arc45 70.2,14.57 85.36,14.57 arc45 87.16,15.32 89.09,17.25 arc-45 90.88,17.99 J7.2
SPK-  (via drill 0.35)
  Top 1.016: v81.84,6.95 82.33,6.95 J7.3
  Bottom 0.61: JP1.2 65.34,55.95 arc-45 66.24,55.58 81.1,40.72
  Bottom 1.016: 81.1,40.72 arc-45 81.84,38.92 v81.84,6.95
SPK_A
  Top 1.016: J7.11 92,12.53 92,13.81 95.07,16.88 arc45 95.81,18.67 95.81,26.69 arc26 95.56,27.8 87.02,45.25 arc64 84.74,46.67 SPK.P$1
SPK_B
  Top 1.016: SPK.P$2 79.3,59.25 arc-45 81.1,58.5 84.24,55.36 arc-19 84.72,54.68 87.94,48.1 97.91,27.73 arc-26 98.16,26.62 98.16,18.25 arc-45 97.42,16.46 J7.10
VBAT  (via drill 0.35)
  Top 1.016: S8.2 v26.73,62.07
  Bottom 1.016: v26.73,62.07 TP1.TP TP2.TP
VCC  (via drill 0.35)
  Top 0.61: v26.73,47.34 U1.8 28.43,50.75 | U1.7 27.5,51.67 | U1.3 26.49,52.69
  Top 1.016: J6.1 v74.22,66.64 | 28.43,50.75 27.5,51.67 26.49,52.69 25.77,53.41 arc-73 25.32,56.39 28.3,61.99 arc-62 30.54,63.34 31,63.34 arc45 Q1.2 32.55,64.63 arc-45 34.34,65.37 38.58,65.37 arc45 40.38,66.12 J1.2 TP7.TP
  Bottom 1.016: v74.22,66.64 59.27,66.64 arc-45 57.48,67.39 56.17,68.69 arc45 54.38,69.44 49.92,69.44 arc-45 48.12,70.18 J1.2 | v26.73,47.34 26.73,40.94 arc45 27.47,39.15 B1.21
VUSB  (via drill 0.35)
  Top 1.016: S8.1 v25.96,60.8
  Bottom 1.016: B1.24 22.39,36.61 arc-45 21.65,38.4 21.65,57.46 arc-45 22.39,59.26 23.19,60.06 arc-45 24.98,60.8 v25.96,60.8

### Text on the board
tPlace: + | RX | + | - | TX | OLED | - | SHINY / SIDE / UP | SPEAKER | B | RESET | A | PRO-MICRO | USB | HEADPHONE | ARDUBOY: KIT | ê | JACK
bPlace: GND | GND | VCC | SCK | MOSI | OLED_RST | MISO | OLED_RST | RST | OLED_CS | VBAT | ARDUBOY.COM | IR/TX | IR/RX | MOSI | [B] | MISO | [A] | SCK | SPK- | [UP] | SPK+ | [RIGHT] | OLED_DC | [LEFT] | NOTE: UTILIZES ALTERNATE WIRING | LED_G | [DOWN] | OLED_RST | VCC | GND | RST | GND | GND | CART_CS | PROTOTYPE AREA | VUSB | OLED_CS